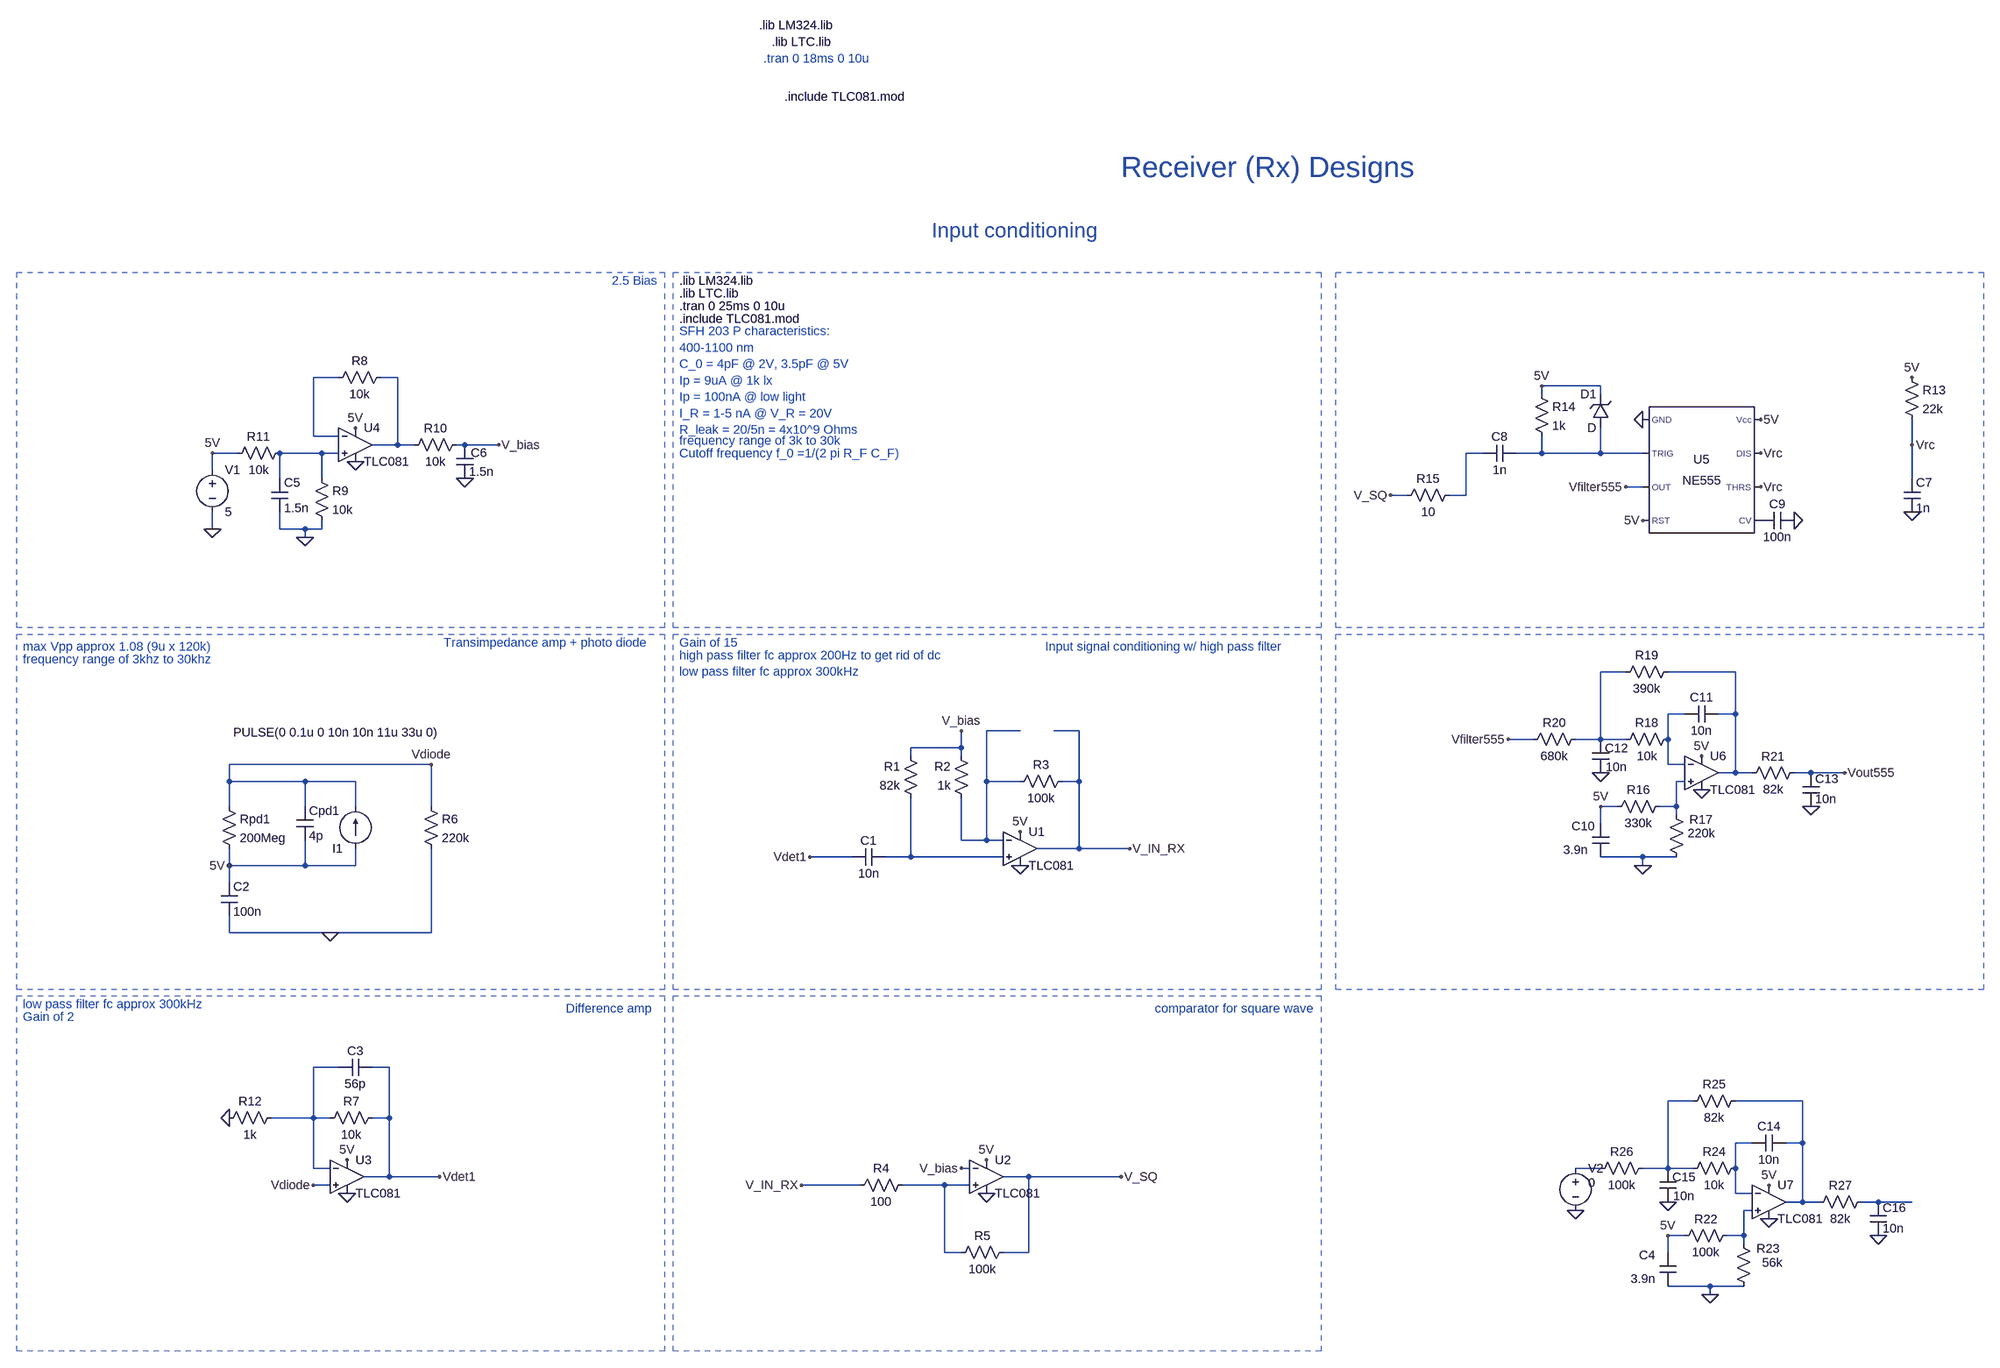
[diagram p0: schematic 555 timer based receiver.asc]
555 timer based receiver.asc, the LTspice schematic file:
Version 4.1
SHEET 1 6428 2800
WIRE 2064 256 2016 256
WIRE 2176 256 2144 256
WIRE 4464 272 4352 272
WIRE 4352 288 4352 272
WIRE 4464 288 4464 272
WIRE 2016 368 2016 256
WIRE 2064 368 2016 368
WIRE 2176 384 2176 256
WIRE 2176 384 2128 384
WIRE 2208 384 2176 384
WIRE 2304 384 2288 384
WIRE 2368 384 2304 384
WIRE 5056 384 5056 336
WIRE 1872 400 1824 400
WIRE 2032 400 1952 400
WIRE 2064 400 2032 400
WIRE 4240 400 4208 400
WIRE 4352 400 4352 368
WIRE 4352 400 4304 400
WIRE 4464 400 4464 352
WIRE 4464 400 4352 400
WIRE 4544 400 4464 400
WIRE 1824 432 1824 400
WIRE 1952 448 1952 400
WIRE 2032 448 2032 400
WIRE 5056 448 5056 384
WIRE 4544 464 4512 464
WIRE 4096 480 4064 480
WIRE 4208 480 4208 400
WIRE 4208 480 4176 480
WIRE 1824 544 1824 512
WIRE 1952 544 1952 512
WIRE 2000 544 1952 544
WIRE 2032 544 2032 528
WIRE 2032 544 2000 544
WIRE 2000 560 2000 544
WIRE 4512 816 4464 816
WIRE 4720 816 4592 816
WIRE 4624 896 4592 896
WIRE 4720 896 4720 816
WIRE 4720 896 4688 896
WIRE 3360 928 3296 928
WIRE 3472 928 3424 928
WIRE 4336 944 4288 944
WIRE 4464 944 4464 816
WIRE 4464 944 4416 944
WIRE 4512 944 4464 944
WIRE 4592 944 4592 896
WIRE 3248 960 3248 928
WIRE 3248 960 3152 960
WIRE 3152 976 3152 960
WIRE 3248 976 3248 960
WIRE 2240 992 1856 992
WIRE 4592 992 4592 944
WIRE 4624 992 4592 992
WIRE 4720 1008 4720 896
WIRE 4720 1008 4688 1008
WIRE 4752 1008 4720 1008
WIRE 4864 1008 4832 1008
WIRE 4928 1008 4864 1008
WIRE 1856 1024 1856 992
WIRE 2000 1024 1856 1024
WIRE 2096 1024 2000 1024
WIRE 3296 1024 3296 928
WIRE 3360 1024 3296 1024
WIRE 3472 1024 3472 928
WIRE 3472 1024 3440 1024
WIRE 4624 1024 4608 1024
WIRE 1856 1072 1856 1024
WIRE 2000 1072 2000 1024
WIRE 2096 1072 2096 1024
WIRE 2240 1072 2240 992
WIRE 4496 1072 4464 1072
WIRE 4608 1072 4608 1024
WIRE 4608 1072 4576 1072
WIRE 4608 1088 4608 1072
WIRE 4464 1104 4464 1072
WIRE 3248 1136 3248 1056
WIRE 3296 1136 3296 1024
WIRE 3296 1136 3248 1136
WIRE 3328 1136 3296 1136
WIRE 3472 1152 3472 1024
WIRE 3472 1152 3392 1152
WIRE 3568 1152 3472 1152
WIRE 3040 1168 2960 1168
WIRE 3152 1168 3152 1056
WIRE 3152 1168 3104 1168
WIRE 3328 1168 3152 1168
WIRE 4544 1168 4464 1168
WIRE 4608 1168 4544 1168
WIRE 1856 1184 1856 1152
WIRE 2000 1184 2000 1136
WIRE 2000 1184 1856 1184
WIRE 2096 1184 2096 1152
WIRE 2096 1184 2000 1184
WIRE 4544 1184 4544 1168
WIRE 1856 1216 1856 1184
WIRE 1856 1312 1856 1280
WIRE 2048 1312 1856 1312
WIRE 2240 1312 2240 1152
WIRE 2240 1312 2048 1312
WIRE 2064 1568 2016 1568
WIRE 2160 1568 2128 1568
WIRE 4640 1632 4592 1632
WIRE 4848 1632 4720 1632
WIRE 2016 1664 2016 1568
WIRE 2016 1664 1936 1664
WIRE 2048 1664 2016 1664
WIRE 2160 1664 2160 1568
WIRE 2160 1664 2128 1664
WIRE 4752 1712 4720 1712
WIRE 4848 1712 4848 1632
WIRE 4848 1712 4816 1712
WIRE 2016 1760 2016 1664
WIRE 2048 1760 2016 1760
WIRE 3264 1760 3248 1760
WIRE 4464 1760 4416 1760
WIRE 4592 1760 4592 1632
WIRE 4592 1760 4544 1760
WIRE 4640 1760 4592 1760
WIRE 4720 1760 4720 1712
WIRE 2160 1776 2160 1664
WIRE 2160 1776 2112 1776
WIRE 2256 1776 2160 1776
WIRE 3376 1776 3328 1776
WIRE 3552 1776 3376 1776
WIRE 2048 1792 2016 1792
WIRE 3056 1792 2944 1792
WIRE 3216 1792 3136 1792
WIRE 3264 1792 3216 1792
WIRE 4720 1808 4720 1760
WIRE 4752 1808 4720 1808
WIRE 4848 1824 4848 1712
WIRE 4848 1824 4816 1824
WIRE 4880 1824 4848 1824
WIRE 4992 1824 4960 1824
WIRE 5056 1824 4992 1824
WIRE 4752 1840 4736 1840
WIRE 4624 1888 4592 1888
WIRE 4736 1888 4736 1840
WIRE 4736 1888 4704 1888
WIRE 4736 1904 4736 1888
WIRE 3216 1920 3216 1792
WIRE 3248 1920 3216 1920
WIRE 3376 1920 3376 1776
WIRE 3376 1920 3328 1920
WIRE 4592 1920 4592 1888
WIRE 4672 1984 4592 1984
WIRE 4736 1984 4672 1984
WIRE 4672 2000 4672 1984
FLAG 3360 1184 0
FLAG 3568 1152 V_IN_RX
FLAG 3360 1120 5V
FLAG 3296 1808 0
FLAG 3552 1776 V_SQ
FLAG 1824 544 0
FLAG 3248 928 V_bias
FLAG 2960 1168 Vdet1
FLAG 3248 1760 V_bias
FLAG 3296 1744 5V
FLAG 2944 1792 V_IN_RX
FLAG 2048 1312 0
FLAG 1856 1184 5V
FLAG 2080 1808 0
FLAG 2080 1744 5V
FLAG 2016 1792 Vdiode
FLAG 2096 416 0
FLAG 2304 448 0
FLAG 1824 400 5V
FLAG 2096 352 5V
FLAG 2368 384 V_bias
FLAG 2256 1776 Vdet1
FLAG 2240 992 Vdiode
FLAG 1856 1664 0
FLAG 2000 560 0
FLAG 4544 336 0
FLAG 4512 464 Vfilter555
FLAG 4544 528 5V
FLAG 4768 336 5V
FLAG 5056 512 0
FLAG 5056 256 5V
FLAG 5056 384 Vrc
FLAG 4768 400 Vrc
FLAG 4768 464 Vrc
FLAG 4352 272 5V
FLAG 4832 528 0
FLAG 4064 480 V_SQ
FLAG 4464 1072 5V
FLAG 4656 976 5V
FLAG 4656 1040 0
FLAG 4544 1184 0
FLAG 4464 1008 0
FLAG 4864 1072 0
FLAG 4288 944 Vfilter555
FLAG 4928 1008 Vout555
FLAG 4592 1888 5V
FLAG 4784 1792 5V
FLAG 4784 1856 0
FLAG 4672 2000 0
FLAG 4592 1824 0
FLAG 4992 1888 0
FLAG 4416 1840 0
SYMBOL Cap 1984 1072 R0
SYMATTR InstName Cpd1
SYMATTR Value 4p
SYMBOL Res 1840 1056 R0
SYMATTR InstName Rpd1
SYMATTR Value 200Meg
SYMBOL current 2096 1152 R180
WINDOW 123 0 0 Left 0
WINDOW 39 0 0 Left 0
WINDOW 3 -159 221 Left 2
SYMATTR Value PULSE(0 0.1u 0 10n 10n 11u 33u 0)
SYMATTR InstName I1
SYMBOL Res 3168 1072 R180
WINDOW 0 36 76 Left 2
WINDOW 3 36 40 Left 2
SYMATTR InstName R1
SYMATTR Value 82k
SYMBOL Res 3264 1072 R180
WINDOW 0 36 76 Left 2
WINDOW 3 36 40 Left 2
SYMATTR InstName R2
SYMATTR Value 1k
SYMBOL opamp2 3360 1088 R0
SYMATTR InstName U1
SYMATTR Value TLC081
SYMBOL Cap 3104 1152 R90
WINDOW 0 0 32 VBottom 2
WINDOW 3 32 32 VTop 2
SYMATTR InstName C1
SYMATTR Value 10n
SYMBOL Res 3456 1008 R90
WINDOW 0 0 56 VBottom 2
WINDOW 3 32 56 VTop 2
SYMATTR InstName R3
SYMATTR Value 100k
SYMBOL opamp2 3296 1712 R0
SYMATTR InstName U2
SYMATTR Value TLC081
SYMBOL Res 3152 1776 R90
WINDOW 0 0 56 VBottom 2
WINDOW 3 32 56 VTop 2
SYMATTR InstName R4
SYMATTR Value 100
SYMBOL Res 3344 1904 R90
WINDOW 0 0 56 VBottom 2
WINDOW 3 32 56 VTop 2
SYMATTR InstName R5
SYMATTR Value 100k
SYMBOL voltage 1824 416 R0
WINDOW 123 0 0 Left 0
WINDOW 39 0 0 Left 0
SYMATTR InstName V1
SYMATTR Value 5
SYMBOL cap 1840 1216 R0
SYMATTR InstName C2
SYMATTR Value 100n
SYMBOL res 2224 1056 R0
SYMATTR InstName R6
SYMATTR Value 220k
SYMBOL opamp2 2080 1712 R0
SYMATTR InstName U3
SYMATTR Value TLC081
SYMBOL Res 2144 1648 R90
WINDOW 0 0 56 VBottom 2
WINDOW 3 32 56 VTop 2
SYMATTR InstName R7
SYMATTR Value 10k
SYMBOL opamp2 2096 320 R0
SYMATTR InstName U4
SYMATTR Value TLC081
SYMBOL res 2160 240 R90
WINDOW 0 0 56 VBottom 2
WINDOW 3 32 56 VTop 2
SYMATTR InstName R8
SYMATTR Value 10k
SYMBOL res 2016 432 R0
SYMATTR InstName R9
SYMATTR Value 10k
SYMBOL res 2304 368 R90
WINDOW 0 0 56 VBottom 2
WINDOW 3 32 56 VTop 2
SYMATTR InstName R10
SYMATTR Value 10k
SYMBOL res 1968 384 R90
WINDOW 0 0 56 VBottom 2
WINDOW 3 32 56 VTop 2
SYMATTR InstName R11
SYMATTR Value 10k
SYMBOL res 1952 1648 R90
WINDOW 0 0 56 VBottom 2
WINDOW 3 32 56 VTop 2
SYMATTR InstName R12
SYMATTR Value 1k
SYMBOL cap 2128 1552 R90
WINDOW 0 0 32 VBottom 2
WINDOW 3 32 32 VTop 2
SYMATTR InstName C3
SYMATTR Value 56p
SYMBOL cap 1936 448 R0
SYMATTR InstName C5
SYMATTR Value 1.5n
SYMBOL cap 2288 384 R0
WINDOW 0 27 15 Left 2
WINDOW 3 24 51 Left 2
SYMATTR InstName C6
SYMATTR Value 1.5n
SYMBOL Misc\\NE555 4656 432 R0
SYMATTR InstName U5
SYMBOL res 5040 240 R0
SYMATTR InstName R13
SYMATTR Value 22k
SYMBOL cap 5040 448 R0
SYMATTR InstName C7
SYMATTR Value 1n
SYMBOL zener 4480 352 R180
WINDOW 0 24 64 Left 2
WINDOW 3 24 0 Left 2
SYMATTR InstName D1
SYMBOL res 4336 272 R0
SYMATTR InstName R14
SYMATTR Value 1k
SYMBOL cap 4304 384 R90
WINDOW 0 0 32 VBottom 2
WINDOW 3 32 32 VTop 2
SYMATTR InstName C8
SYMATTR Value 1n
SYMBOL res 4192 464 R90
WINDOW 0 0 56 VBottom 2
WINDOW 3 32 56 VTop 2
SYMATTR InstName R15
SYMATTR Value 10
SYMBOL cap 4832 512 R90
WINDOW 0 0 32 VBottom 2
WINDOW 3 32 32 VTop 2
SYMATTR InstName C9
SYMATTR Value 100n
SYMBOL opamp2 4656 944 R0
SYMATTR InstName U6
SYMATTR Value TLC081
SYMBOL res 4592 1056 R90
WINDOW 0 0 56 VBottom 2
WINDOW 3 32 56 VTop 2
SYMATTR InstName R16
SYMATTR Value 330k
SYMBOL res 4624 1184 R180
WINDOW 0 -53 87 Left 2
WINDOW 3 -58 61 Left 2
SYMATTR InstName R17
SYMATTR Value 220k
SYMBOL cap 4448 1104 R0
WINDOW 0 -39 5 Left 2
WINDOW 3 -55 50 Left 2
SYMATTR InstName C10
SYMATTR Value 3.9n
SYMBOL cap 4688 880 R90
WINDOW 0 0 32 VBottom 2
WINDOW 3 32 32 VTop 2
SYMATTR InstName C11
SYMATTR Value 10n
SYMBOL res 4608 928 R90
WINDOW 0 0 56 VBottom 2
WINDOW 3 32 56 VTop 2
SYMATTR InstName R18
SYMATTR Value 10k
SYMBOL cap 4448 944 R0
WINDOW 0 24 17 Left 2
WINDOW 3 26 53 Left 2
SYMATTR InstName C12
SYMATTR Value 10n
SYMBOL res 4608 800 R90
WINDOW 0 0 56 VBottom 2
WINDOW 3 32 56 VTop 2
SYMATTR InstName R19
SYMATTR Value 390k
SYMBOL res 4432 928 R90
WINDOW 0 0 56 VBottom 2
WINDOW 3 32 56 VTop 2
SYMATTR InstName R20
SYMATTR Value 680k
SYMBOL res 4848 992 R90
WINDOW 0 0 56 VBottom 2
WINDOW 3 32 56 VTop 2
SYMATTR InstName R21
SYMATTR Value 82k
SYMBOL cap 4848 1008 R0
WINDOW 0 24 11 Left 2
WINDOW 3 24 50 Left 2
SYMATTR InstName C13
SYMATTR Value 10n
SYMBOL opamp2 4784 1760 R0
SYMATTR InstName U7
SYMATTR Value TLC081
SYMBOL res 4720 1872 R90
WINDOW 0 0 56 VBottom 2
WINDOW 3 32 56 VTop 2
SYMATTR InstName R22
SYMATTR Value 100k
SYMBOL res 4752 2000 R180
WINDOW 0 -53 87 Left 2
WINDOW 3 -58 61 Left 2
SYMATTR InstName R23
SYMATTR Value 56k
SYMBOL cap 4576 1920 R0
WINDOW 0 -39 5 Left 2
WINDOW 3 -55 50 Left 2
SYMATTR InstName C4
SYMATTR Value 3.9n
SYMBOL cap 4816 1696 R90
WINDOW 0 0 32 VBottom 2
WINDOW 3 32 32 VTop 2
SYMATTR InstName C14
SYMATTR Value 10n
SYMBOL res 4736 1744 R90
WINDOW 0 0 56 VBottom 2
WINDOW 3 32 56 VTop 2
SYMATTR InstName R24
SYMATTR Value 10k
SYMBOL cap 4576 1760 R0
WINDOW 0 24 17 Left 2
WINDOW 3 26 53 Left 2
SYMATTR InstName C15
SYMATTR Value 10n
SYMBOL res 4736 1616 R90
WINDOW 0 0 56 VBottom 2
WINDOW 3 32 56 VTop 2
SYMATTR InstName R25
SYMATTR Value 82k
SYMBOL res 4560 1744 R90
WINDOW 0 0 56 VBottom 2
WINDOW 3 32 56 VTop 2
SYMATTR InstName R26
SYMATTR Value 100k
SYMBOL res 4976 1808 R90
WINDOW 0 0 56 VBottom 2
WINDOW 3 32 56 VTop 2
SYMATTR InstName R27
SYMATTR Value 82k
SYMBOL cap 4976 1824 R0
WINDOW 0 24 11 Left 2
WINDOW 3 24 50 Left 2
SYMATTR InstName C16
SYMATTR Value 10n
SYMBOL voltage 4416 1744 R0
WINDOW 3 24 44 Left 2
WINDOW 123 0 0 Left 0
WINDOW 39 0 0 Left 0
SYMATTR InstName V2
SYMATTR Value 0
TEXT 2864 -736 Left 2 !.lib LM324.lib
TEXT 2872 -672 Left 2 ;.tran 0 18ms 0 10u
TEXT 2888 -704 Left 2 !.lib LTC.lib
TEXT 2912 -600 Left 2 !.include TLC081.mod
TEXT 3552 -144 Left 5 ;Receiver (Rx) Designs
TEXT 2712 72 Left 2 !.lib LM324.lib
TEXT 2712 120 Left 2 !.tran 0 25ms 0 10u
TEXT 2712 96 Left 2 !.lib LTC.lib
TEXT 2712 144 Left 2 !.include TLC081.mod
TEXT 3192 -24 Left 4 ;Input conditioning
TEXT 3408 768 Left 2 ;Input signal conditioning w/ high pass filter
TEXT 3616 1456 Left 2 ;comparator for square wave
TEXT 2712 168 Left 2 ;SFH 203 P characteristics:\n400-1100 nm\nC_0 = 4pF @ 2V, 3.5pF @ 5V\nIp = 9uA @ 1k lx\nIp = 100nA @ low light\nI_R = 1-5 nA @ V_R = 20V\nR_leak = 20/5n = 4x10^9 Ohms
TEXT 2712 400 Left 2 ;Cutoff frequency f_0 =1/(2 pi R_F C_F)
TEXT 2712 376 Left 2 ;frequency range of 3k to 30k
TEXT 2712 760 Left 2 ;Gain of 15
TEXT 2712 784 Left 2 ;high pass filter fc approx 200Hz to get rid of dc\nlow pass filter fc approx 300kHz
TEXT 2584 72 Left 2 ;2.5 Bias
TEXT 2264 760 Left 2 ;Transimpedance amp + photo diode
TEXT 2496 1456 Left 2 ;Difference amp
TEXT 1464 1448 Left 2 ;low pass filter fc approx 300kHz
TEXT 1464 1472 Left 2 ;Gain of 2
TEXT 1464 768 Left 2 ;max Vpp approx 1.08 (9u x 120k)
TEXT 1464 792 Left 2 ;frequency range of 3khz to 30khz
RECTANGLE Normal 2700 56 3932 732 2
RECTANGLE Normal 2700 744 3932 1420 2
RECTANGLE Normal 2700 1432 3932 2108 2
RECTANGLE Normal 1452 56 2684 732 2
RECTANGLE Normal 1452 744 2684 1420 2
RECTANGLE Normal 1452 1432 2684 2108 2
RECTANGLE Normal 3960 56 5192 732 2
RECTANGLE Normal 3960 744 5192 1420 2

The netlist it stands for:
* 555 timer based receiver.asc
Cpd1 Vdiode 5V 4p
Rpd1 Vdiode 5V 200Meg
I1 5V Vdiode PULSE(0 0.1u 0 10n 10n 11u 33u 0)
R1 N011 V_bias 82k
R2 N009 V_bias 1k
X§U1 N011 N009 5V 0 V_IN_RX TLC081  ; pins In+ In- V+ V- OUT
C1 N011 Vdet1 10n
R3 V_IN_RX N009 100k
X§U2 N017 V_bias 5V 0 V_SQ TLC081  ; pins In+ In- V+ V- OUT
R4 N017 V_IN_RX 100
R5 V_SQ N017 100k
V1 5V 0 5
C2 5V 0 100n
R6 Vdiode 0 220k
X§U3 Vdiode N012 5V 0 Vdet1 TLC081  ; pins In+ In- V+ V- OUT
R7 Vdet1 N012 10k
X§U4 N003 N001 5V 0 N002 TLC081  ; pins In+ In- V+ V- OUT
R8 N002 N001 10k
R9 N003 0 10k
R10 V_bias N002 10k
R11 N003 5V 10k
R12 N012 0 1k
C3 Vdet1 N012 56p
C5 N003 0 1.5n
C6 V_bias 0 1.5n
X§U5 0 N005 Vfilter555 5V P001 Vrc Vrc 5V NE555  ; pins GND TRIG OUT RST CV THRS DIS Vcc
R13 5V Vrc 22k
C7 Vrc 0 1n
D1 N005 5V D
R14 5V N005 1k
C8 N005 N004 1n
R15 N004 V_SQ 10
C9 0 P001 100n
X§U6 N010 N008 5V 0 N007 TLC081  ; pins In+ In- V+ V- OUT
R16 N010 5V 330k
R17 0 N010 220k
C10 5V 0 3.9n
C11 N007 N008 10n
R18 N008 N006 10k
C12 N006 0 10n
R19 N007 N006 390k
R20 N006 Vfilter555 680k
R21 Vout555 N007 82k
C13 Vout555 0 10n
X§U7 N019 N015 5V 0 N014 TLC081  ; pins In+ In- V+ V- OUT
R22 N019 5V 100k
R23 0 N019 56k
C4 5V 0 3.9n
C14 N014 N015 10n
R24 N015 N013 10k
C15 N013 0 10n
R25 N014 N013 82k
R26 N013 N016 100k
R27 N018 N014 82k
C16 N018 0 10n
V2 N016 0 0
.model D D
.lib standard.dio
.lib LM324.lib
* .tran 0 18ms 0 10u
.lib LTC.lib
.include TLC081.mod
* Receiver (Rx) Designs
.lib LM324.lib
.tran 0 25ms 0 10u
.lib LTC.lib
.include TLC081.mod
* Input conditioning
* Input signal conditioning w/ high pass filter
* comparator for square wave
* SFH 203 P characteristics:
* 400-1100 nm
* C_0 = 4pF @ 2V, 3.5pF @ 5V
* Ip = 9uA @ 1k lx
* Ip = 100nA @ low light
* I_R = 1-5 nA @ V_R = 20V
* R_leak = 20/5n = 4x10^9 Ohms
* Cutoff frequency f_0 =1/(2 pi R_F C_F)
* frequency range of 3k to 30k
* Gain of 15
* high pass filter fc approx 200Hz to get rid of dc
* low pass filter fc approx 300kHz
* 2.5 Bias
* Transimpedance amp + photo diode
* Difference amp
* low pass filter fc approx 300kHz
* Gain of 2
* max Vpp approx 1.08 (9u x 120k)
* frequency range of 3khz to 30khz
.lib NE555.sub
.backanno
.end